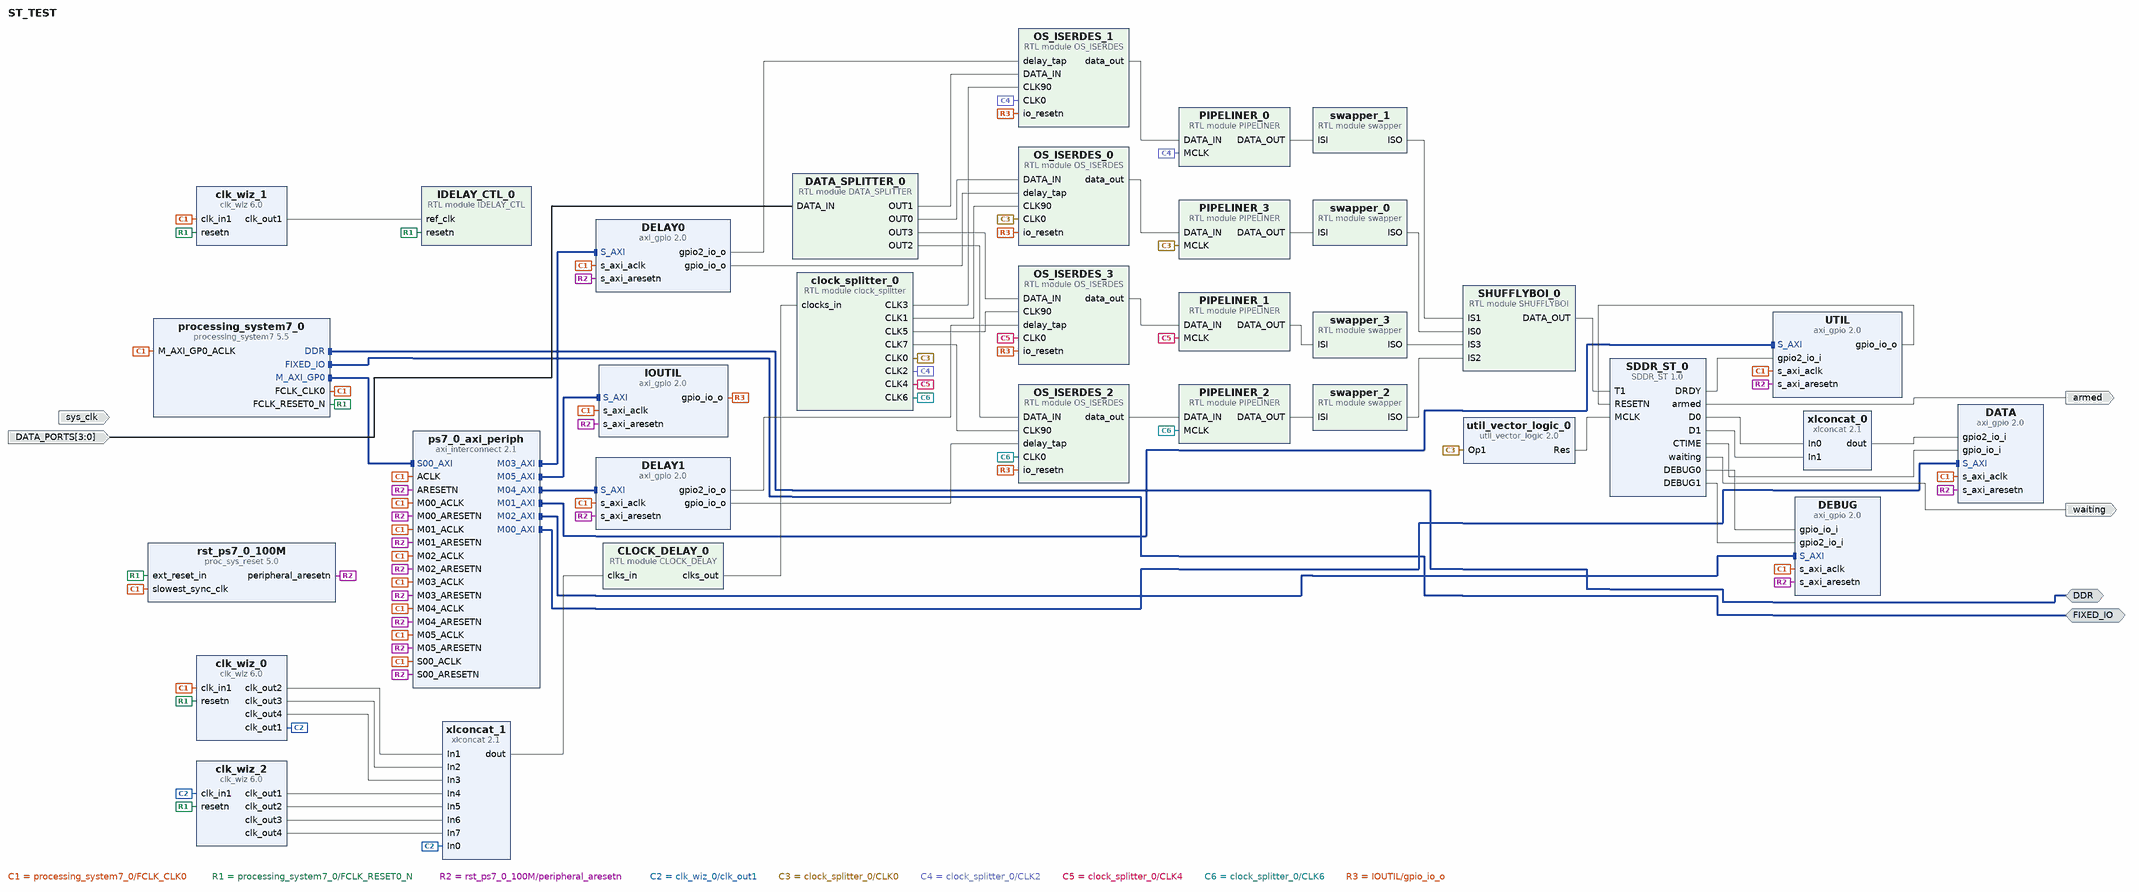
[diagram p0: block diagram of the top level]
# Vivado block design ST_TEST, xc7z020clg400-1, Vivado 2019.1
create_bd_design ST_TEST

create_bd_intf_port -mode Master -vlnv xilinx.com:interface:ddrx_rtl:1.0 DDR
create_bd_intf_port -mode Master -vlnv xilinx.com:display_processing_system7:fixedio_rtl:1.0 FIXED_IO
create_bd_port -dir I -from 3 -to 0 -type data DATA_PORTS
create_bd_port -dir I -type clk sys_clk
set_property -dict {CONFIG.FREQ_HZ 125000000} [get_bd_ports sys_clk]
create_bd_port -dir O waiting
create_bd_port -dir O armed

create_bd_cell -type ip -vlnv cri.nz:user:SDDR_ST:1.0 SDDR_ST_0
set_property -dict {CONFIG.SIG_WIDTH 16} [get_bd_cells SDDR_ST_0]
create_bd_cell -type module -reference swapper swapper_0
create_bd_cell -type module -reference swapper swapper_1
create_bd_cell -type module -reference SHUFFLYBOI SHUFFLYBOI_0
set_property -dict {CONFIG.factor 4 CONFIG.input_width 4} [get_bd_cells SHUFFLYBOI_0]
create_bd_cell -type ip -vlnv xilinx.com:ip:clk_wiz:6.0 clk_wiz_0
set_property -dict [list \
  CONFIG.CLKOUT1_JITTER 127.220 \
  CONFIG.CLKOUT1_PHASE_ERROR 105.461 \
  CONFIG.CLKOUT1_REQUESTED_OUT_FREQ 150 \
  CONFIG.CLKOUT2_JITTER 127.220 \
  CONFIG.CLKOUT2_PHASE_ERROR 105.461 \
  CONFIG.CLKOUT2_REQUESTED_OUT_FREQ 150 \
  CONFIG.CLKOUT2_REQUESTED_PHASE 90 \
  CONFIG.CLKOUT2_USED true \
  CONFIG.CLKOUT3_JITTER 127.220 \
  CONFIG.CLKOUT3_PHASE_ERROR 105.461 \
  CONFIG.CLKOUT3_REQUESTED_OUT_FREQ 150 \
  CONFIG.CLKOUT3_REQUESTED_PHASE 22.5 \
  CONFIG.CLKOUT3_USED true \
  CONFIG.CLKOUT4_JITTER 127.220 \
  CONFIG.CLKOUT4_PHASE_ERROR 105.461 \
  CONFIG.CLKOUT4_REQUESTED_OUT_FREQ 150 \
  CONFIG.CLKOUT4_REQUESTED_PHASE 112.5 \
  CONFIG.CLKOUT4_USED true \
  CONFIG.JITTER_SEL No_Jitter \
  CONFIG.MMCM_BANDWIDTH OPTIMIZED \
  CONFIG.MMCM_CLKFBOUT_MULT_F 9.000 \
  CONFIG.MMCM_CLKIN1_PERIOD 10.000 \
  CONFIG.MMCM_CLKIN2_PERIOD 10.000 \
  CONFIG.MMCM_CLKOUT0_DIVIDE_F 6.000 \
  CONFIG.MMCM_CLKOUT1_DIVIDE 6 \
  CONFIG.MMCM_CLKOUT1_PHASE 90.000 \
  CONFIG.MMCM_CLKOUT2_DIVIDE 6 \
  CONFIG.MMCM_CLKOUT2_PHASE 22.500 \
  CONFIG.MMCM_CLKOUT3_DIVIDE 6 \
  CONFIG.MMCM_CLKOUT3_PHASE 112.500 \
  CONFIG.MMCM_DIVCLK_DIVIDE 1 \
  CONFIG.NUM_OUT_CLKS 4 \
  CONFIG.RESET_PORT resetn \
  CONFIG.RESET_TYPE ACTIVE_LOW \
  CONFIG.USE_LOCKED true \
] [get_bd_cells clk_wiz_0]
create_bd_cell -type module -reference DATA_SPLITTER DATA_SPLITTER_0
create_bd_cell -type ip -vlnv xilinx.com:ip:clk_wiz:6.0 clk_wiz_1
set_property -dict [list \
  CONFIG.CLKOUT1_JITTER 204.659 \
  CONFIG.CLKOUT1_PHASE_ERROR 297.890 \
  CONFIG.CLKOUT1_REQUESTED_OUT_FREQ 310 \
  CONFIG.MMCM_CLKFBOUT_MULT_F 50.375 \
  CONFIG.MMCM_CLKOUT0_DIVIDE_F 3.250 \
  CONFIG.MMCM_DIVCLK_DIVIDE 5 \
  CONFIG.RESET_PORT resetn \
  CONFIG.RESET_TYPE ACTIVE_LOW \
  CONFIG.USE_LOCKED false \
] [get_bd_cells clk_wiz_1]
create_bd_cell -type ip -vlnv xilinx.com:ip:axi_gpio:2.0 DATA
set_property -dict {CONFIG.C_ALL_INPUTS 1 CONFIG.C_ALL_INPUTS_2 1 CONFIG.C_GPIO2_WIDTH 16 CONFIG.C_IS_DUAL 1} [get_bd_cells DATA]
create_bd_cell -type ip -vlnv xilinx.com:ip:xlconcat:2.1 xlconcat_0
create_bd_cell -type ip -vlnv xilinx.com:ip:axi_gpio:2.0 UTIL
set_property -dict [list \
  CONFIG.C_ALL_INPUTS 0 \
  CONFIG.C_ALL_INPUTS_2 1 \
  CONFIG.C_ALL_OUTPUTS 1 \
  CONFIG.C_GPIO2_WIDTH 1 \
  CONFIG.C_GPIO_WIDTH 1 \
  CONFIG.C_IS_DUAL 1 \
] [get_bd_cells UTIL]
create_bd_cell -type ip -vlnv xilinx.com:ip:axi_gpio:2.0 DEBUG
set_property -dict {CONFIG.C_ALL_INPUTS 1 CONFIG.C_ALL_INPUTS_2 1 CONFIG.C_IS_DUAL 1} [get_bd_cells DEBUG]
create_bd_cell -type ip -vlnv xilinx.com:ip:processing_system7:5.5 processing_system7_0
set_property -dict [list \
  CONFIG.PCW_APU_PERIPHERAL_FREQMHZ 650 \
  CONFIG.PCW_CRYSTAL_PERIPHERAL_FREQMHZ 50 \
  CONFIG.PCW_ENET0_ENET0_IO {MIO 16 .. 27} \
  CONFIG.PCW_ENET0_GRP_MDIO_ENABLE 1 \
  CONFIG.PCW_ENET0_GRP_MDIO_IO {MIO 52 .. 53} \
  CONFIG.PCW_ENET0_PERIPHERAL_ENABLE 1 \
  CONFIG.PCW_ENET0_RESET_ENABLE 1 \
  CONFIG.PCW_ENET0_RESET_IO {MIO 9} \
  CONFIG.PCW_ENET_RESET_ENABLE 1 \
  CONFIG.PCW_ENET_RESET_SELECT {Share reset pin} \
  CONFIG.PCW_FPGA0_PERIPHERAL_FREQMHZ 100 \
  CONFIG.PCW_FPGA1_PERIPHERAL_FREQMHZ 50 \
  CONFIG.PCW_GPIO_MIO_GPIO_ENABLE 1 \
  CONFIG.PCW_GPIO_MIO_GPIO_IO MIO \
  CONFIG.PCW_I2C_RESET_ENABLE 1 \
  CONFIG.PCW_M_AXI_GP0_FREQMHZ 10 \
  CONFIG.PCW_PERIPHERAL_BOARD_PRESET None \
  CONFIG.PCW_PRESET_BANK1_VOLTAGE {LVCMOS 1.8V} \
  CONFIG.PCW_QSPI_GRP_FBCLK_ENABLE 1 \
  CONFIG.PCW_QSPI_GRP_FBCLK_IO {MIO 8} \
  CONFIG.PCW_QSPI_GRP_SINGLE_SS_ENABLE 1 \
  CONFIG.PCW_QSPI_GRP_SINGLE_SS_IO {MIO 1 .. 6} \
  CONFIG.PCW_QSPI_PERIPHERAL_ENABLE 1 \
  CONFIG.PCW_QSPI_QSPI_IO {MIO 1 .. 6} \
  CONFIG.PCW_SD0_GRP_CD_ENABLE 1 \
  CONFIG.PCW_SD0_GRP_CD_IO {MIO 47} \
  CONFIG.PCW_SD0_GRP_WP_ENABLE 0 \
  CONFIG.PCW_SD0_PERIPHERAL_ENABLE 1 \
  CONFIG.PCW_SD0_SD0_IO {MIO 40 .. 45} \
  CONFIG.PCW_SDIO_PERIPHERAL_FREQMHZ 50 \
  CONFIG.PCW_SINGLE_QSPI_DATA_MODE x4 \
  CONFIG.PCW_UART0_PERIPHERAL_ENABLE 1 \
  CONFIG.PCW_UART0_UART0_IO {MIO 14 .. 15} \
  CONFIG.PCW_UART1_PERIPHERAL_ENABLE 0 \
  CONFIG.PCW_UART_PERIPHERAL_FREQMHZ 100 \
  CONFIG.PCW_UIPARAM_DDR_BUS_WIDTH {16 Bit} \
  CONFIG.PCW_UIPARAM_DDR_FREQ_MHZ 525 \
  CONFIG.PCW_UIPARAM_DDR_PARTNO {MT41J256M16 RE-125} \
  CONFIG.PCW_USB0_PERIPHERAL_ENABLE 1 \
  CONFIG.PCW_USB0_RESET_ENABLE 1 \
  CONFIG.PCW_USB0_RESET_IO {MIO 46} \
  CONFIG.PCW_USB0_USB0_IO {MIO 28 .. 39} \
  CONFIG.PCW_USB_RESET_ENABLE 1 \
  CONFIG.PCW_USB_RESET_SELECT {Share reset pin} \
] [get_bd_cells processing_system7_0]
# 481 more settings of processing_system7_0 are not shown: defaults, MIO pin electricals, DDR timing, and values the tool derives
create_bd_cell -type ip -vlnv xilinx.com:ip:axi_interconnect:2.1 ps7_0_axi_periph
set_property -dict {CONFIG.NUM_MI 6} [get_bd_cells ps7_0_axi_periph]
create_bd_cell -type ip -vlnv xilinx.com:ip:proc_sys_reset:5.0 rst_ps7_0_100M
create_bd_cell -type ip -vlnv xilinx.com:ip:axi_gpio:2.0 DELAY0
set_property -dict [list \
  CONFIG.C_ALL_OUTPUTS 1 \
  CONFIG.C_ALL_OUTPUTS_2 1 \
  CONFIG.C_GPIO2_WIDTH 5 \
  CONFIG.C_GPIO_WIDTH 5 \
  CONFIG.C_IS_DUAL 1 \
] [get_bd_cells DELAY0]
create_bd_cell -type ip -vlnv xilinx.com:ip:axi_gpio:2.0 DELAY1
set_property -dict [list \
  CONFIG.C_ALL_OUTPUTS 1 \
  CONFIG.C_ALL_OUTPUTS_2 1 \
  CONFIG.C_GPIO2_WIDTH 5 \
  CONFIG.C_GPIO_WIDTH 5 \
  CONFIG.C_IS_DUAL 1 \
] [get_bd_cells DELAY1]
create_bd_cell -type module -reference IDELAY_CTL IDELAY_CTL_0
set_property -dict {CONFIG.idelay_group IDELAY_SERDES} [get_bd_cells IDELAY_CTL_0]
create_bd_cell -type module -reference OS_ISERDES OS_ISERDES_0
set_property -dict {CONFIG.idelay_group IDELAY_SERDES} [get_bd_cells OS_ISERDES_0]
create_bd_cell -type module -reference OS_ISERDES OS_ISERDES_1
set_property -dict {CONFIG.idelay_group IDELAY_SERDES} [get_bd_cells OS_ISERDES_1]
create_bd_cell -type module -reference OS_ISERDES OS_ISERDES_2
set_property -dict {CONFIG.idelay_group IDELAY_SERDES} [get_bd_cells OS_ISERDES_2]
create_bd_cell -type module -reference OS_ISERDES OS_ISERDES_3
set_property -dict {CONFIG.idelay_group IDELAY_SERDES} [get_bd_cells OS_ISERDES_3]
create_bd_cell -type ip -vlnv xilinx.com:ip:clk_wiz:6.0 clk_wiz_2
set_property -dict [list \
  CONFIG.CLKIN1_JITTER_PS 126.65400000000001 \
  CONFIG.CLKIN1_UI_JITTER 0.019 \
  CONFIG.CLKOUT1_JITTER 115.543 \
  CONFIG.CLKOUT1_PHASE_ERROR 99.204 \
  CONFIG.CLKOUT1_REQUESTED_DUTY_CYCLE 50.0 \
  CONFIG.CLKOUT1_REQUESTED_OUT_FREQ 150 \
  CONFIG.CLKOUT1_REQUESTED_PHASE 45 \
  CONFIG.CLKOUT2_JITTER 115.543 \
  CONFIG.CLKOUT2_PHASE_ERROR 99.204 \
  CONFIG.CLKOUT2_REQUESTED_DUTY_CYCLE 50.0 \
  CONFIG.CLKOUT2_REQUESTED_OUT_FREQ 150 \
  CONFIG.CLKOUT2_REQUESTED_PHASE 135 \
  CONFIG.CLKOUT2_USED true \
  CONFIG.CLKOUT3_JITTER 115.543 \
  CONFIG.CLKOUT3_PHASE_ERROR 99.204 \
  CONFIG.CLKOUT3_REQUESTED_DUTY_CYCLE 50.0 \
  CONFIG.CLKOUT3_REQUESTED_OUT_FREQ 150 \
  CONFIG.CLKOUT3_REQUESTED_PHASE 67.5 \
  CONFIG.CLKOUT3_USED true \
  CONFIG.CLKOUT4_JITTER 115.543 \
  CONFIG.CLKOUT4_PHASE_ERROR 99.204 \
  CONFIG.CLKOUT4_REQUESTED_DUTY_CYCLE 50.0 \
  CONFIG.CLKOUT4_REQUESTED_OUT_FREQ 150 \
  CONFIG.CLKOUT4_REQUESTED_PHASE 157.5 \
  CONFIG.CLKOUT4_USED true \
  CONFIG.JITTER_SEL No_Jitter \
  CONFIG.MMCM_BANDWIDTH OPTIMIZED \
  CONFIG.MMCM_CLKFBOUT_MULT_F 6.000 \
  CONFIG.MMCM_CLKIN1_PERIOD 6.667 \
  CONFIG.MMCM_CLKIN2_PERIOD 10.0 \
  CONFIG.MMCM_CLKOUT0_DIVIDE_F 6.000 \
  CONFIG.MMCM_CLKOUT0_DUTY_CYCLE 0.500 \
  CONFIG.MMCM_CLKOUT0_PHASE 45.000 \
  CONFIG.MMCM_CLKOUT1_DIVIDE 6 \
  CONFIG.MMCM_CLKOUT1_DUTY_CYCLE 0.500 \
  CONFIG.MMCM_CLKOUT1_PHASE 135.000 \
  CONFIG.MMCM_CLKOUT2_DIVIDE 6 \
  CONFIG.MMCM_CLKOUT2_PHASE 67.500 \
  CONFIG.MMCM_CLKOUT3_DIVIDE 6 \
  CONFIG.MMCM_CLKOUT3_PHASE 157.500 \
  CONFIG.MMCM_DIVCLK_DIVIDE 1 \
  CONFIG.MMCM_REF_JITTER1 0.019 \
  CONFIG.NUM_OUT_CLKS 4 \
  CONFIG.RESET_PORT resetn \
  CONFIG.RESET_TYPE ACTIVE_LOW \
  CONFIG.USE_LOCKED true \
  CONFIG.USE_MIN_POWER false \
  CONFIG.USE_SPREAD_SPECTRUM false \
] [get_bd_cells clk_wiz_2]
create_bd_cell -type module -reference swapper swapper_2
create_bd_cell -type module -reference swapper swapper_3
create_bd_cell -type ip -vlnv xilinx.com:ip:xlconcat:2.1 xlconcat_1
set_property -dict {CONFIG.NUM_PORTS 8} [get_bd_cells xlconcat_1]
create_bd_cell -type module -reference clock_splitter clock_splitter_0
create_bd_cell -type ip -vlnv xilinx.com:ip:util_vector_logic:2.0 util_vector_logic_0
set_property -dict {CONFIG.C_OPERATION not CONFIG.C_SIZE 1} [get_bd_cells util_vector_logic_0]
create_bd_cell -type module -reference CLOCK_DELAY CLOCK_DELAY_0
set_property -dict [list \
  CONFIG.delay0 15 \
  CONFIG.delay1 16 \
  CONFIG.delay2 15 \
  CONFIG.delay3 19 \
  CONFIG.delay4 1 \
  CONFIG.delay5 11 \
  CONFIG.delay7 10 \
  CONFIG.delay_group IDELAY_SERDES \
] [get_bd_cells CLOCK_DELAY_0]
create_bd_cell -type module -reference PIPELINER PIPELINER_0
create_bd_cell -type module -reference PIPELINER PIPELINER_1
create_bd_cell -type module -reference PIPELINER PIPELINER_2
create_bd_cell -type module -reference PIPELINER PIPELINER_3
create_bd_cell -type ip -vlnv xilinx.com:ip:axi_gpio:2.0 IOUTIL
set_property -dict {CONFIG.C_ALL_OUTPUTS 1 CONFIG.C_GPIO_WIDTH 1} [get_bd_cells IOUTIL]

# ---- connections ----

connect_bd_intf_net [get_bd_intf_pins ps7_0_axi_periph/M05_AXI] [get_bd_intf_pins IOUTIL/S_AXI]
connect_bd_intf_net [get_bd_intf_ports DDR] [get_bd_intf_pins processing_system7_0/DDR]
connect_bd_intf_net [get_bd_intf_pins ps7_0_axi_periph/M04_AXI] [get_bd_intf_pins DELAY1/S_AXI]
connect_bd_intf_net [get_bd_intf_ports FIXED_IO] [get_bd_intf_pins processing_system7_0/FIXED_IO]
connect_bd_intf_net [get_bd_intf_pins ps7_0_axi_periph/M03_AXI] [get_bd_intf_pins DELAY0/S_AXI]
connect_bd_intf_net [get_bd_intf_pins ps7_0_axi_periph/M01_AXI] [get_bd_intf_pins UTIL/S_AXI]
connect_bd_intf_net [get_bd_intf_pins ps7_0_axi_periph/M02_AXI] [get_bd_intf_pins DEBUG/S_AXI]
connect_bd_intf_net [get_bd_intf_pins processing_system7_0/M_AXI_GP0] [get_bd_intf_pins ps7_0_axi_periph/S00_AXI]
connect_bd_intf_net [get_bd_intf_pins ps7_0_axi_periph/M00_AXI] [get_bd_intf_pins DATA/S_AXI]
connect_bd_net [get_bd_pins SHUFFLYBOI_0/DATA_OUT] [get_bd_pins SDDR_ST_0/T1]
connect_bd_net [get_bd_pins swapper_0/ISO] [get_bd_pins SHUFFLYBOI_0/IS0]
connect_bd_net [get_bd_pins swapper_1/ISO] [get_bd_pins SHUFFLYBOI_0/IS1]
connect_bd_net [get_bd_ports DATA_PORTS] [get_bd_pins DATA_SPLITTER_0/DATA_IN]
connect_bd_net [get_bd_pins DATA_SPLITTER_0/OUT0] [get_bd_pins OS_ISERDES_0/DATA_IN]
connect_bd_net [get_bd_pins DATA_SPLITTER_0/OUT1] [get_bd_pins OS_ISERDES_1/DATA_IN]
connect_bd_net [get_bd_pins clk_wiz_1/clk_out1] [get_bd_pins IDELAY_CTL_0/ref_clk]
connect_bd_net [get_bd_pins SDDR_ST_0/armed] [get_bd_ports armed]
connect_bd_net [get_bd_pins SDDR_ST_0/waiting] [get_bd_ports waiting]
connect_bd_net [get_bd_pins SDDR_ST_0/CTIME] [get_bd_pins DATA/gpio_io_i]
connect_bd_net [get_bd_pins SDDR_ST_0/D0] [get_bd_pins xlconcat_0/In0]
connect_bd_net [get_bd_pins SDDR_ST_0/D1] [get_bd_pins xlconcat_0/In1]
connect_bd_net [get_bd_pins xlconcat_0/dout] [get_bd_pins DATA/gpio2_io_i]
connect_bd_net [get_bd_pins UTIL/gpio_io_o] [get_bd_pins SDDR_ST_0/RESETN]
connect_bd_net [get_bd_pins SDDR_ST_0/DRDY] [get_bd_pins UTIL/gpio2_io_i]
connect_bd_net [get_bd_pins SDDR_ST_0/DEBUG0] [get_bd_pins DEBUG/gpio_io_i]
connect_bd_net [get_bd_pins SDDR_ST_0/DEBUG1] [get_bd_pins DEBUG/gpio2_io_i]
connect_bd_net [get_bd_pins processing_system7_0/FCLK_CLK0] \
  [get_bd_pins processing_system7_0/M_AXI_GP0_ACLK] [get_bd_pins ps7_0_axi_periph/S00_ACLK] \
  [get_bd_pins rst_ps7_0_100M/slowest_sync_clk] [get_bd_pins DATA/s_axi_aclk] [get_bd_pins ps7_0_axi_periph/M00_ACLK] \
  [get_bd_pins ps7_0_axi_periph/ACLK] [get_bd_pins UTIL/s_axi_aclk] [get_bd_pins ps7_0_axi_periph/M01_ACLK] \
  [get_bd_pins DEBUG/s_axi_aclk] [get_bd_pins ps7_0_axi_periph/M02_ACLK] [get_bd_pins DELAY0/s_axi_aclk] \
  [get_bd_pins ps7_0_axi_periph/M03_ACLK] [get_bd_pins DELAY1/s_axi_aclk] [get_bd_pins ps7_0_axi_periph/M04_ACLK] \
  [get_bd_pins clk_wiz_1/clk_in1] [get_bd_pins IOUTIL/s_axi_aclk] [get_bd_pins ps7_0_axi_periph/M05_ACLK] \
  [get_bd_pins clk_wiz_0/clk_in1]
connect_bd_net [get_bd_pins processing_system7_0/FCLK_RESET0_N] \
  [get_bd_pins rst_ps7_0_100M/ext_reset_in] [get_bd_pins clk_wiz_1/resetn] [get_bd_pins IDELAY_CTL_0/resetn] \
  [get_bd_pins clk_wiz_0/resetn] [get_bd_pins clk_wiz_2/resetn]
connect_bd_net [get_bd_pins rst_ps7_0_100M/peripheral_aresetn] \
  [get_bd_pins ps7_0_axi_periph/S00_ARESETN] [get_bd_pins DATA/s_axi_aresetn] [get_bd_pins ps7_0_axi_periph/M00_ARESETN] \
  [get_bd_pins ps7_0_axi_periph/ARESETN] [get_bd_pins UTIL/s_axi_aresetn] [get_bd_pins ps7_0_axi_periph/M01_ARESETN] \
  [get_bd_pins DEBUG/s_axi_aresetn] [get_bd_pins ps7_0_axi_periph/M02_ARESETN] [get_bd_pins DELAY0/s_axi_aresetn] \
  [get_bd_pins ps7_0_axi_periph/M03_ARESETN] [get_bd_pins DELAY1/s_axi_aresetn] [get_bd_pins ps7_0_axi_periph/M04_ARESETN] \
  [get_bd_pins IOUTIL/s_axi_aresetn] [get_bd_pins ps7_0_axi_periph/M05_ARESETN]
connect_bd_net [get_bd_pins DELAY0/gpio_io_o] [get_bd_pins OS_ISERDES_0/delay_tap]
connect_bd_net [get_bd_pins DELAY0/gpio2_io_o] [get_bd_pins OS_ISERDES_1/delay_tap]
connect_bd_net [get_bd_pins DATA_SPLITTER_0/OUT2] [get_bd_pins OS_ISERDES_2/DATA_IN]
connect_bd_net [get_bd_pins DATA_SPLITTER_0/OUT3] [get_bd_pins OS_ISERDES_3/DATA_IN]
connect_bd_net [get_bd_pins DELAY1/gpio_io_o] [get_bd_pins OS_ISERDES_2/delay_tap]
connect_bd_net [get_bd_pins DELAY1/gpio2_io_o] [get_bd_pins OS_ISERDES_3/delay_tap]
connect_bd_net [get_bd_pins swapper_2/ISO] [get_bd_pins SHUFFLYBOI_0/IS2]
connect_bd_net [get_bd_pins swapper_3/ISO] [get_bd_pins SHUFFLYBOI_0/IS3]
connect_bd_net [get_bd_pins xlconcat_1/dout] [get_bd_pins CLOCK_DELAY_0/clks_in]
connect_bd_net [get_bd_pins CLOCK_DELAY_0/clks_out] [get_bd_pins clock_splitter_0/clocks_in]
connect_bd_net [get_bd_pins clk_wiz_0/clk_out1] [get_bd_pins xlconcat_1/In0] [get_bd_pins clk_wiz_2/clk_in1]
connect_bd_net [get_bd_pins clk_wiz_0/clk_out2] [get_bd_pins xlconcat_1/In1]
connect_bd_net [get_bd_pins clk_wiz_0/clk_out3] [get_bd_pins xlconcat_1/In2]
connect_bd_net [get_bd_pins clk_wiz_0/clk_out4] [get_bd_pins xlconcat_1/In3]
connect_bd_net [get_bd_pins clk_wiz_2/clk_out1] [get_bd_pins xlconcat_1/In4]
connect_bd_net [get_bd_pins clk_wiz_2/clk_out2] [get_bd_pins xlconcat_1/In5]
connect_bd_net [get_bd_pins clk_wiz_2/clk_out3] [get_bd_pins xlconcat_1/In6]
connect_bd_net [get_bd_pins clk_wiz_2/clk_out4] [get_bd_pins xlconcat_1/In7]
connect_bd_net [get_bd_pins clock_splitter_0/CLK0] \
  [get_bd_pins OS_ISERDES_0/CLK0] [get_bd_pins util_vector_logic_0/Op1] [get_bd_pins PIPELINER_3/MCLK]
connect_bd_net [get_bd_pins clock_splitter_0/CLK1] [get_bd_pins OS_ISERDES_0/CLK90]
connect_bd_net [get_bd_pins clock_splitter_0/CLK2] [get_bd_pins OS_ISERDES_1/CLK0] [get_bd_pins PIPELINER_0/MCLK]
connect_bd_net [get_bd_pins clock_splitter_0/CLK3] [get_bd_pins OS_ISERDES_1/CLK90]
connect_bd_net [get_bd_pins clock_splitter_0/CLK4] [get_bd_pins OS_ISERDES_3/CLK0] [get_bd_pins PIPELINER_1/MCLK]
connect_bd_net [get_bd_pins clock_splitter_0/CLK5] [get_bd_pins OS_ISERDES_3/CLK90]
connect_bd_net [get_bd_pins clock_splitter_0/CLK6] [get_bd_pins OS_ISERDES_2/CLK0] [get_bd_pins PIPELINER_2/MCLK]
connect_bd_net [get_bd_pins clock_splitter_0/CLK7] [get_bd_pins OS_ISERDES_2/CLK90]
connect_bd_net [get_bd_pins util_vector_logic_0/Res] [get_bd_pins SDDR_ST_0/MCLK]
connect_bd_net [get_bd_pins OS_ISERDES_1/data_out] [get_bd_pins PIPELINER_0/DATA_IN]
connect_bd_net [get_bd_pins PIPELINER_0/DATA_OUT] [get_bd_pins swapper_1/ISI]
connect_bd_net [get_bd_pins OS_ISERDES_3/data_out] [get_bd_pins PIPELINER_1/DATA_IN]
connect_bd_net [get_bd_pins PIPELINER_1/DATA_OUT] [get_bd_pins swapper_3/ISI]
connect_bd_net -net PIPELINER_1_DATA_OUT1 [get_bd_pins PIPELINER_2/DATA_OUT] [get_bd_pins swapper_2/ISI]
connect_bd_net [get_bd_pins OS_ISERDES_2/data_out] [get_bd_pins PIPELINER_2/DATA_IN]
connect_bd_net [get_bd_pins PIPELINER_3/DATA_OUT] [get_bd_pins swapper_0/ISI]
connect_bd_net [get_bd_pins OS_ISERDES_0/data_out] [get_bd_pins PIPELINER_3/DATA_IN]
connect_bd_net [get_bd_pins IOUTIL/gpio_io_o] \
  [get_bd_pins OS_ISERDES_2/io_resetn] [get_bd_pins OS_ISERDES_3/io_resetn] [get_bd_pins OS_ISERDES_1/io_resetn] \
  [get_bd_pins OS_ISERDES_0/io_resetn]

# ---- address map ----
assign_bd_address -offset 0x41200000 -range 64K -target_address_space [get_bd_addr_spaces processing_system7_0/Data] [get_bd_addr_segs DATA/S_AXI/Reg]
assign_bd_address -offset 0x41210000 -range 64K -target_address_space [get_bd_addr_spaces processing_system7_0/Data] [get_bd_addr_segs UTIL/S_AXI/Reg]
assign_bd_address -offset 0x41220000 -range 64K -target_address_space [get_bd_addr_spaces processing_system7_0/Data] [get_bd_addr_segs DELAY0/S_AXI/Reg]
assign_bd_address -offset 0x41230000 -range 64K -target_address_space [get_bd_addr_spaces processing_system7_0/Data] [get_bd_addr_segs DELAY1/S_AXI/Reg]
assign_bd_address -offset 0x41240000 -range 64K -target_address_space [get_bd_addr_spaces processing_system7_0/Data] [get_bd_addr_segs DEBUG/S_AXI/Reg]
assign_bd_address -offset 0x41250000 -range 64K -target_address_space [get_bd_addr_spaces processing_system7_0/Data] [get_bd_addr_segs IOUTIL/S_AXI/Reg]

validate_bd_design
save_bd_design
